# EAGLE design fen (EAGLE 8.3.2)
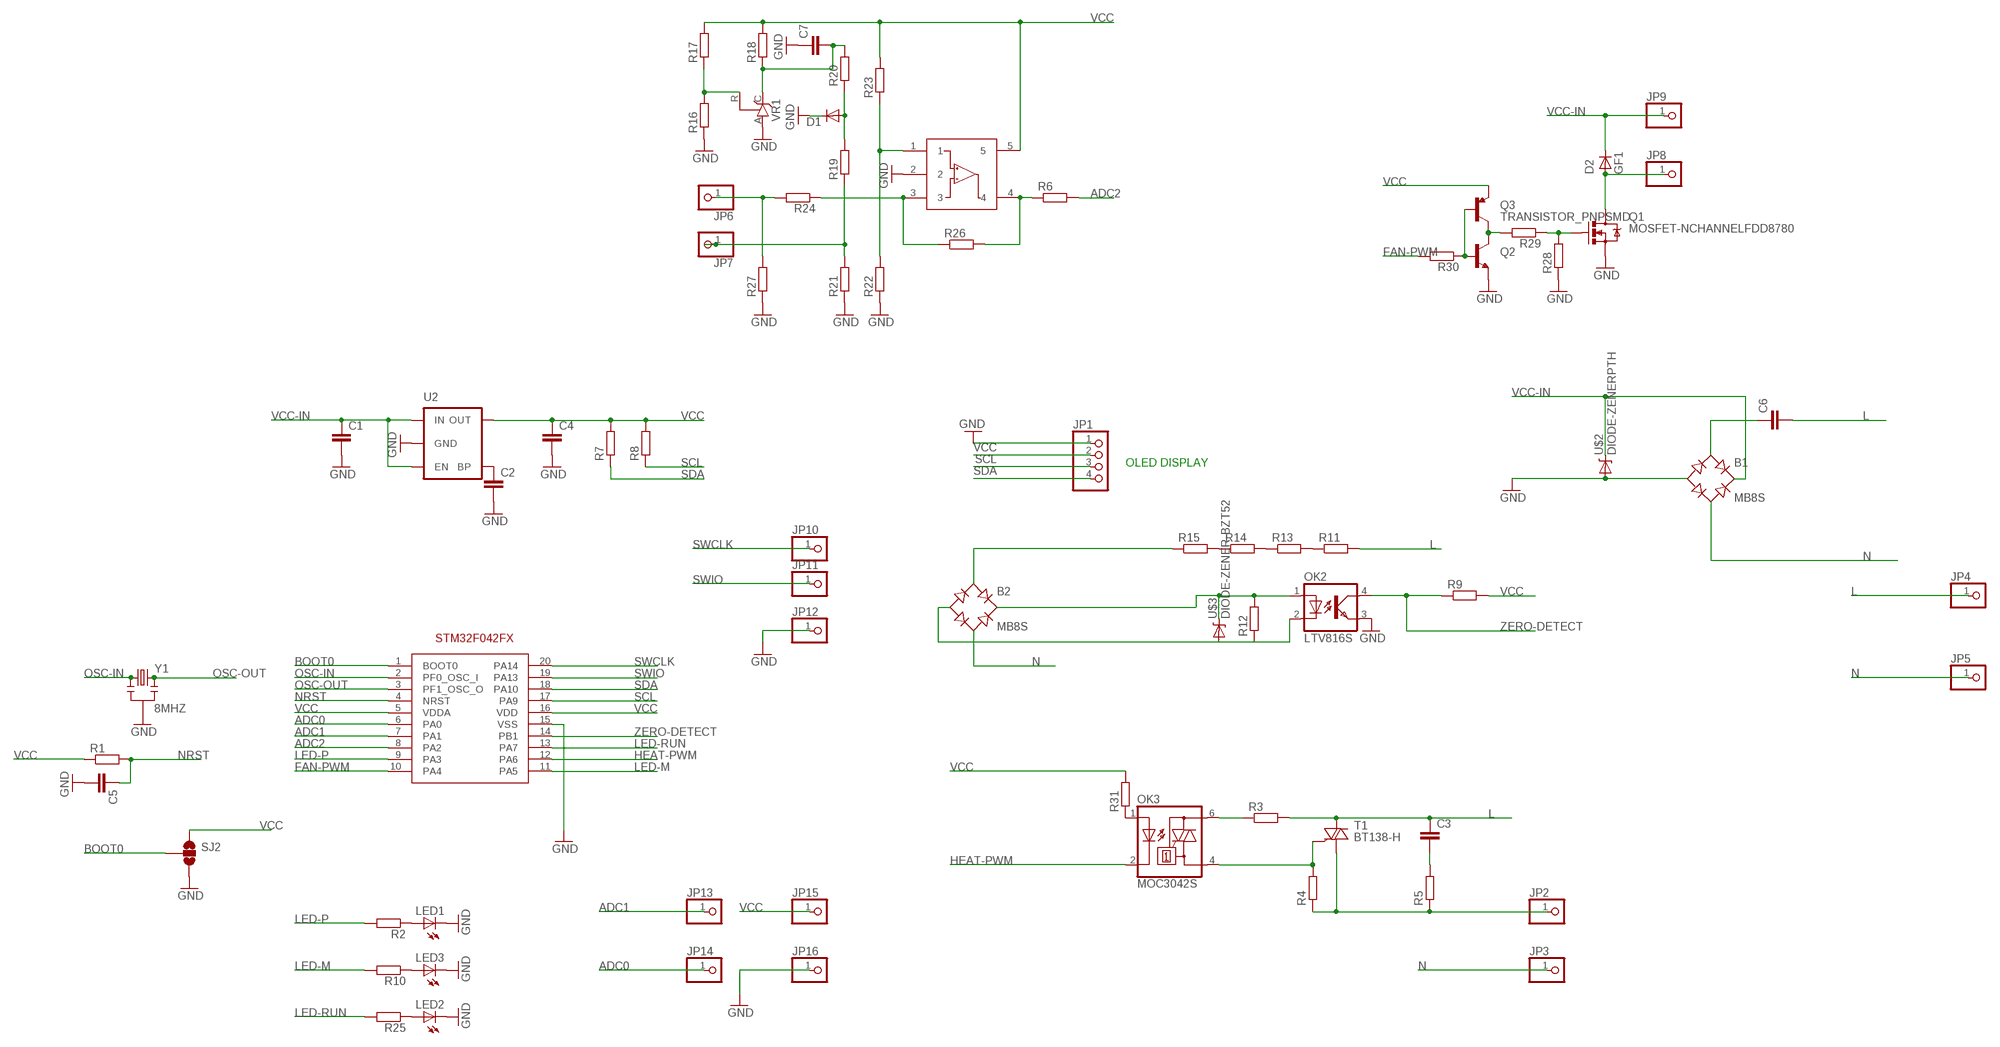
[diagram p0: schematic, sheet 1]

## Parts
B1  MB8S  [SOIC-4]
B2  MB8S  [SOIC-4]
C1  C-EUC0805  [C0805]
C2  C-EUC0603  [C0603]
C3  C-EUC1206  [C1206]
C4  C-EUC0805  [C0805]
C5  C-EUC0603  [C0603]
C6  C-EU150-072X183  [C150-072X183]
C7  C-EUC0805  [C0805]
D1  DIODE1N4148  [DIODE-1N4148]
D2  GF1  [SMA-DO214AC]
JP1  PINHD-1X4  [1X04]
JP2  PINHD-1X1  [1X01]
JP3  PINHD-1X1  [1X01]
JP4  PINHD-1X1  [1X01]
JP5  PINHD-1X1  [1X01]
JP6  PINHD-1X1  [1X01]
JP7  PINHD-1X1  [1X01]
JP8  PINHD-1X1  [1X01]
JP9  PINHD-1X1  [1X01]
JP10  PINHD-1X1  [1X01]
JP11  PINHD-1X1  [1X01]
JP12  PINHD-1X1  [1X01]
JP13  PINHD-1X1  [1X01]
JP14  PINHD-1X1  [1X01]
JP15  PINHD-1X1  [1X01]
JP16  PINHD-1X1  [1X01]
LED1  LED0603  [LED-0603]
LED2  LED0603  [LED-0603]
LED3  LED0603  [LED-0603]
OK2  LTV816S  [SMD4]
OK3  MOC3042S  [DIL6-SMD]
Q1  MOSFET-NCHANNELFDD8780  [DPAK]
Q2  TRANSISTOR_NPNSOT23  [SOT23]
Q3  TRANSISTOR_PNPSMD  [SOT23-3]
R1  R-EU_R0603  [R0603]
R2  R-EU_R0603  [R0603]
R3  R-EU_R1206  [R1206]
R4  R-EU_R1206  [R1206]
R5  R-EU_R1206  [R1206]
R6  R-EU_R0603  [R0603]
R7  R-EU_R0603  [R0603]
R8  R-EU_R0603  [R0603]
R9  R-EU_R0603  [R0603]
R10  R-EU_R0603  [R0603]
R11  R-EU_R1206  [R1206]
R12  R-EU_R0603  [R0603]
R13  R-EU_R1206  [R1206]
R14  R-EU_R1206  [R1206]
R15  R-EU_R1206  [R1206]
R16  R-EU_R0603  [R0603]
R17  R-EU_R0603  [R0603]
R18  R-EU_R0603  [R0603]
R19  R-EU_R0603  [R0603]
R20  R-EU_R0603  [R0603]
R21  R-EU_R0603  [R0603]
R22  R-EU_R0603  [R0603]
R23  R-EU_R0603  [R0603]
R24  R-EU_R0603  [R0603]
R25  R-EU_R0603  [R0603]
R26  R-EU_R0603  [R0603]
R27  R-EU_R0603  [R0603]
R28  R-EU_R0603  [R0603]
R29  R-EU_R0603  [R0603]
R30  R-EU_R0603  [R0603]
R31  R-EU_R0603  [R0603]
SJ2  SOLDERJUMPER_2WAYS  [SJ_3]
T1  BT138-H  [TO220BH]
U1  STM32F042FX  [TSSOP20]
U2  MIC52053.3V  [SOT23-5]
U$1  LMV321M5  [SOT23-5]
U$2  DIODE-ZENERPTH  [DIODE-ZENER]
U$3  DIODE-ZENER-BZT52  [SOD-323]
VR1  TL431CLP  [TO92-CLP]
Y1  8MHZ  RESONATOR8MHZ  [RESONATOR-SMD]

## Nets
ADC0: JP14.1 U1.6(PA0)
ADC1: JP13.1 U1.7(PA1)
ADC2: R6.2 U1.8(PA2)
BOOT0: SJ2.2 U1.1(BOOT0)
FAN-PWM: R30.2 U1.10(PA4)
GND: B1.- C1.2 C2.2 C4.2 C5.2 C7.1 D1.C JP1.1 JP12.1 JP16.1 LED1.C LED2.C LED3.C OK2.3(EMIT) Q1.3(S) Q2.2(E) R16.1 R21.1 R22.1 R27.1 R28.1 SJ2.3 U1.15(VSS) U2.2(GND) U$1.2 U$2.P$2(A) VR1.A Y1.2
HEAT-PWM: OK3.2(C) U1.12(PA6)
L: C3.1 C6.2 JP4.1 R3.2 R11.2 T1.T2(A2)
LED-M: R10.2 U1.11(PA5)
LED-P: R2.2 U1.9(PA3)
LED-RUN: R25.2 U1.13(PA7)
N: B1.~2(AC2) B2.~2(AC2) JP3.1 JP5.1
N$1: LED2.A R25.1
N$2: OK3.4(A1) R4.2 T1.G
N$3: OK3.6(A2) R3.1
N$4: C3.2 R5.2
N$5: JP2.1 R4.1 R5.1 T1.T1(A1)
N$6: R6.1 R26.2 U$1.4
N$7: C2.1 U2.4(BP)
N$8: B2.- OK2.2(C) R12.1 U$3.2(A)
N$10: B1.~1(AC1) C6.1
N$11: R11.1 R13.2
N$12: R14.1 R15.2
N$13: R13.1 R14.2
N$14: OK3.1(A) R31.1
N$15: B2.+ OK2.1(A) R12.2 U$3.1(C)
N$16: R16.2 R17.1 VR1.R
N$17: D2.A JP8.1 Q1.4(D)
N$18: C7.2 R18.1 R20.2 VR1.C
N$19: R22.2 R23.1 U$1.1
N$20: R24.1 R26.1 U$1.3
N$21: JP6.1 R24.2 R27.2
N$22: JP7.1 R19.1 R21.2
N$23: D1.A R19.2 R20.1
N$24: Q1.1(G) R28.2 R29.1
N$25: Q2.3(C) Q3.3(C) R29.2
N$26: Q2.1(B) Q3.1(B) R30.1
N$27: B2.~1(AC1) R15.1
N$28: LED3.A R10.1
N$29: LED1.A R2.1
NRST: C5.1 R1.2 U1.4(NRST)
OSC-IN: U1.2(PF0_OSC_I) Y1.1
OSC-OUT: U1.3(PF1_OSC_O) Y1.3
SCL: JP1.3 R8.1 U1.17(PA9)
SDA: JP1.4 R7.1 U1.18(PA10)
SWCLK: JP10.1 U1.20(PA14)
SWIO: JP11.1 U1.19(PA13)
VCC: C4.1 JP1.2 JP15.1 Q3.2(E) R1.1 R7.2 R8.2 R9.2 R17.2 R18.2 R23.2 R31.2 SJ2.1 U1.5(VDDA) U1.16(VDD) U2.5(OUT) U$1.5
VCC-IN: B1.+ C1.1 D2.K(C) JP9.1 U2.1(IN) U2.3(EN) U$2.P$1(C)
ZERO-DETECT: OK2.4(COL) R9.1 U1.14(PB1)

## Notes on the sheet
- OLED DISPLAY

## Library data of the parts
B1 B2 = rectifier:MB*S: Bridge Rectifier Source: http://www.fairchildsemi.com/ds/MB/MB6S.pdf
C1-C7 = rcl:C-EU: CAPACITOR, European symbol
D1 = SparkFun-DiscreteSemi:DIODE: Diode These are standard reverse protection diodes and small signal diodes. SMA package can handle up to about 1A. SOD-323 can handle about 200mA. What the SOD-323 package when ordering, there are some mfgs out there that are 5-pin packages.
D2 = diode:GF1: DIODE
JP1 = pinhead:PINHD-1X4: PIN HEADER
JP2-JP16 = pinhead:PINHD-1X1: PIN HEADER
LED1-LED3 = SparkFun-LED:LED: LEDs Standard schematic elements and footprints for 5mm, 3mm, 1206, and 0603 sized LEDs. 5mm - Spark Fun Electronics SKU : COM-00529 (and others)
OK2 = optocoupler:LTV816: OPTO COUPLER Source: LITEON, LTV816.pdf; OC_FARNELL: unknown; OC_NEWARK: unknown
OK3 = optocoupler:MOC30*: 6-Pin DIP Zero-Cross Optoisolators Triac Driver Output (250/400 Volt Peak) Source: Data sheet <http://www.fairchildsemi.com/ds/MO/MOC3031M.pdf> The old path of data sheet not more available 2013-05-06.; MF: FAIRCHILD SEMICONDUCTOR; MPN: MOC3042SM; OC_FARNELL: unknown; OC_NEWARK: 34C1339
Q1 = SparkFun-DiscreteSemi:MOSFET-NCHANNEL: Common NMOSFET Parts MFG P/N Store ID Prod ID FDD8780 TRANS-09984 SI7820DN TRANS-11055 FDS6630A IC-08089 2N7002PW TRANS-11151 FQP30N06L COM-10213 TRANS-10060 BSS123LT1G TRANS-08345 BSS138 TRANS-00830 BS170 2N7000; PROD_ID: TRANS-09984
Q2 = SparkFun-DiscreteSemi:TRANSISTOR_NPN: Generic NPN BJT. MMBT2222 is the common NPN we use. Double check against datasheet- not all devices are the same!
Q3 = SparkFun-DiscreteSemi:TRANSISTOR_PNP: Generic PNP BJT. Double check pinouts against datasheets- not all devices are the same!
R1-R31 = rcl:R-EU_: RESISTOR, European symbol
SJ2 = SparkFun-Passives:SOLDERJUMPER_2WAY: Solder Jumper 2 way solder jumper
T1 = triac:BT138: TRIAC Source: http://www.semiconductors.philips.com BT138_SERIES_2.pdf
U1 = STM32F042Fx:STM32F042FX: STM32F042Fx microcontroller
U2 = SparkFun-PowerIC:MIC5205: MIC5205 150mA vreg 3.3V - VREG-00822 5V - VREG-00823; PROD_ID: VREG-00822
U$1 = SparkFun-AnalogIC:LMV321M5
U$2 U$3 = SparkFun-DiscreteSemi:DIODE-ZENER: Zener Diode Production Part - 8199 3.4V Zener Voltage
VR1 = v-reg:TL431CLP: VOLTAGE REGULATOR
Y1 = SparkFun-FreqCtrl:RESONATOR: Resonator Small SMD resonator. Used, eg, on the Arduino Pro/ Pro Mini boards. 8MHz- XTAL-08895 16MHz- XTAL-08900; PROD_ID: XTAL-08895

## Board
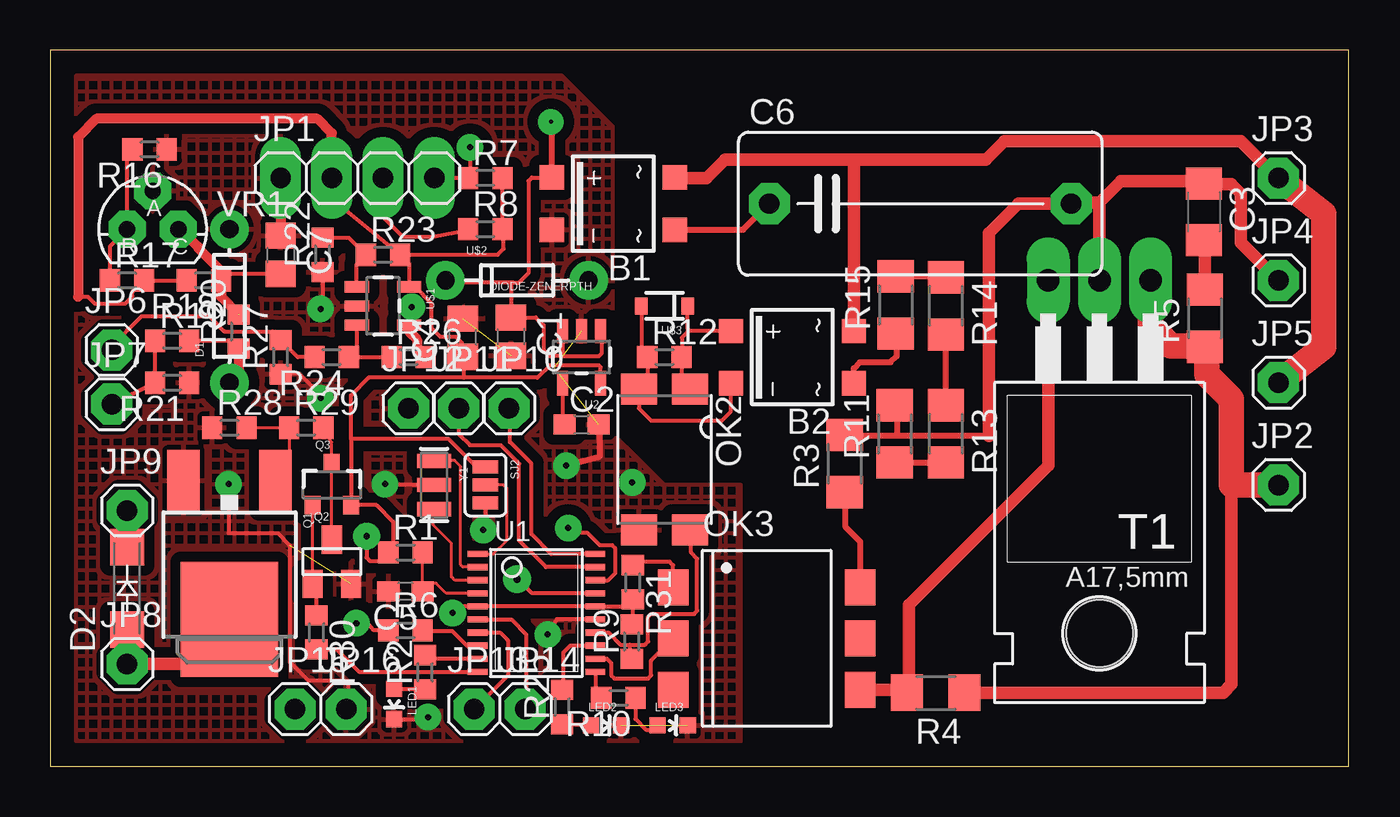
[diagram p1: board, top side]
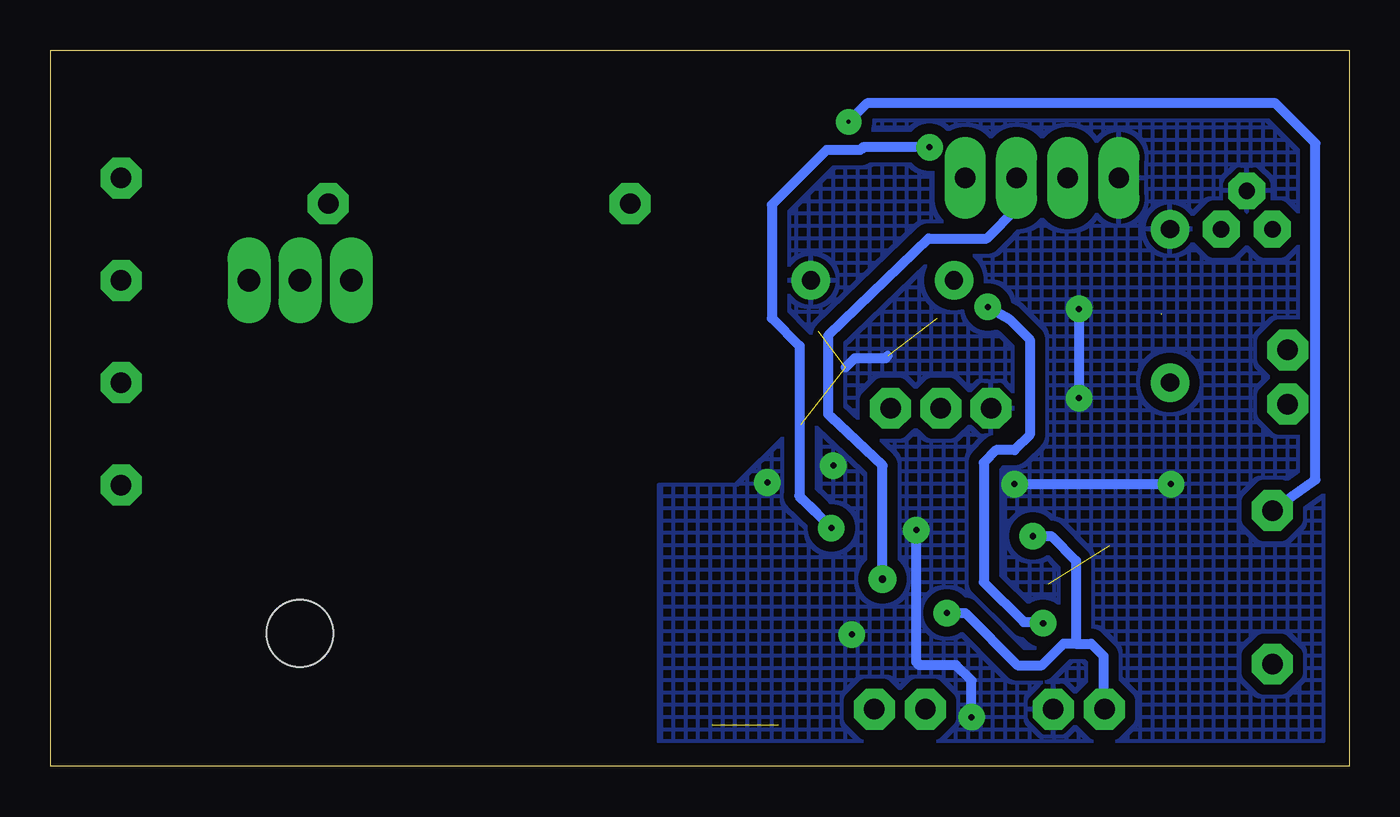
[diagram p2: board, bottom side, seen from below]

Size 64.44 x 35.55 mm. Coordinates in mm from the lower left corner, seen from the top.
Outline: 0,0 64.44,0 64.44,35.55 0,35.55 0,0
Copper layers (1*16): Top 0.035mm / dielectric 1.5mm / Bottom 0.035mm
Design rules "default *": minimum track width 20mil, minimum drill 24mil, track to track 20mil, track to pad 20mil, pad to pad 20mil, via to via 20mil, smd to smd 8mil, copper to edge 40mil, drill to drill 20mil, minimum pad ring 20mil, minimum via ring 20mil, stop-mask expansion 4mil, vias tented up to drill 0mil, thermal gap 10mil

### Footprints (pad centres in the part's own frame; a part is rotated, then mirrored left to right if it is on the bottom)
SOIC-4 = smd 1.2 x 1.2: + 1.3,3.05; - -1.3,3.05; ~1 -1.3,-3.05; ~2 1.3,-3.05
C0805 = smd 1.3 x 1.5: 1 -0.95,0; 2 0.95,0
C0603 = smd 1.1 x 1: 1 -0.85,0; 2 0.85,0
C1206 = smd 1.6 x 1.8: 1 -1.4,0; 2 1.4,0
C150-072X183 = drill 1.016 octagon: 1 -7.493,0; 2 7.493,0
DIODE-1N4148 = drill 0.9 pad 1.88: A -3.81,0; C 3.81,0
SMA-DO214AC = smd 1.8 x 1.7: A -2.05,0; K 2.05,0
1X04 = drill 1.016 long: 1 -3.81,0; 2 -1.27,0; 3 1.27,0; 4 3.81,0
1X01 = drill 1.016 octagon: 1 0,0
LED-0603 = smd 0.8 x 0.8: A 0,-0.75; C 0,0.75
SMD4 = smd 1.78 x 1.55: 1 -1.27,-3.5; 2 1.27,-3.5; 3 1.27,3.5; 4 -1.27,3.5
DIL6-SMD = smd 1.78 x 1.52: 1 -2.54,-4.645; 2 0,-4.645; 3 2.54,-4.645; 4 2.54,4.645; 5 0,4.645; 6 -2.54,4.645
DPAK = smd 1.6 x 3: 1 -2.28,-5.31; 3 2.28,-5.31 | smd 4.826 x 5.715: 4 0,1.588
SOT23 = smd 1 x 1.4: 1 -0.95,-1.1; 2 0.95,-1.1; 3 0,1.1
SOT23-3 = smd 0.8 x 0.9: 1 -0.95,-1; 2 0.95,-1; 3 0,1.1
R0603 = smd 1 x 1.1: 1 -0.85,0; 2 0.85,0
R1206 = smd 1.6 x 1.803: 1 -1.422,0; 2 1.422,0
SJ_3 = smd 0.635 x 1.27: 1 -0.889,0; 2 0,0; 3 0.889,0
TO220BH = drill 1.118 long: G 2.54,-6.35; T1 -2.54,-6.35; T2 0,-6.35 | hole 3.302: 0,11.176
TSSOP20 = smd 0.305 x 0.991: 1 -2.925,-2.918; 2 -2.275,-2.918; 3 -1.625,-2.918; 4 -0.975,-2.918; 5 -0.325,-2.918; 6 0.325,-2.918; 7 0.975,-2.918; 8 1.625,-2.918; 9 2.275,-2.918; 10 2.925,-2.918; 11 2.925,2.918; 12 2.275,2.918; 13 1.625,2.918; 14 0.975,2.918; 15 0.325,2.918; 16 -0.325,2.918; 17 -0.975,2.918; 18 -1.625,2.918; 19 -2.275,2.918; 20 -2.925,2.918
SOT23-5 = smd 0.55 x 1.2: 1 -0.95,-1.3; 2 0,-1.3; 3 0.95,-1.3; 4 0.95,1.3; 5 -0.95,1.3
DIODE-ZENER = drill 0.9: P$1 -3.556,0; P$2 3.556,0
SOD-323 = smd 0.63 x 0.83: 1 -1.15,0; 2 1.15,0
TO92-CLP = drill 0.813 octagon: A 0,1.905; C 1.27,0; R -1.27,0
RESONATOR-SMD = smd 0.7 x 1.7: 1 -1.2,0; 2 0,0; 3 1.2,0

### Placement (x,y rotation side)
B1  27.94,27.94 90 top
B2  36.83,20.32 90 top
C1  22.86,21.34 270 top
C2  26.37,16.97 0 top
C3  57.25,27.53 270 top
C4  20.47,21.29 90 top
C5  17.63,8.69 180 top
C6  43.18,27.94 0 top
C7  11.43,25.4 270 top
D1  8.89,22.86 90 top
D2  3.81,8.84 90 top
JP1  15.24,29.21 0 top
JP2  60.96,13.97 0 top
JP3  60.96,29.21 0 top
JP4  60.96,24.13 0 top
JP5  60.96,19.05 0 top
JP6  3.05,20.68 0 top
JP7  3.05,17.98 0 top
JP8  3.81,5.08 0 top
JP9  3.81,12.7 0 top
JP10  22.76,17.78 0 top
JP11  20.27,17.78 0 top
JP12  17.78,17.78 0 top
JP13  21.03,2.84 0 top
JP14  23.57,2.84 0 top
JP15  12.14,2.84 0 top
JP16  14.68,2.84 0 top
LED1  17.07,3.1 180 top
LED2  27.58,2.03 270 top
LED3  30.89,2.03 270 top
OK2  30.48,15.24 180 top
OK3  35.56,6.35 270 top
Q1  8.89,8.89 180 top
Q2  13.97,10.16 0 top
Q3  13.97,13.97 0 top
R1  17.63,10.62 0 top
R2  18.59,4.67 90 top
R3  39.42,15.04 90 top
R4  43.94,3.66 180 top
R5  57.3,22.25 90 top
R6  17.63,6.76 0 top
R7  21.59,29.21 0 top
R8  21.59,26.67 0 top
R9  28.85,6.2 90 top
R10  28.19,3.4 180 top
R11  41.91,16.51 90 top
R12  30.48,20.32 0 top
R13  44.45,16.51 270 top
R14  44.45,22.86 270 top
R15  41.96,22.91 90 top
R16  4.93,30.63 180 top
R17  3.81,24.13 0 top
R18  7.62,24.13 180 top
R19  6.05,21.13 0 top
R20  9.35,21.59 90 top
R21  6.05,19.05 180 top
R22  13.51,25.4 90 top
R23  16.51,25.4 0 top
R24  13.97,20.32 180 top
R25  25.4,2.95 90 top
R26  17.78,20.32 0 top
R27  11.43,20.32 90 top
R28  8.89,16.81 0 top
R29  12.7,16.81 0 top
R30  13.21,6.65 270 top
R31  28.91,9.14 270 top
SJ2  21.59,13.97 270 top
T1  52.07,17.78 180 top
U1  24.13,7.62 270 top
U2  26.37,20.32 180 top
U$1  16.51,22.86 270 top
U$2  23.16,24.13 0 top
U$3  30.48,22.86 180 top
VR1  5.08,26.67 0 top
Y1  19.05,13.97 270 top

### Tracks (layer width: path | path; a pad name or v marks a point on that pad's centre or on a via)
ADC0
  Top 0.203: U1.6 22.88,7.29 23.62,6.55 23.62,2.9 JP14.1
ADC1
  Top 0.203: U1.7 22.31,6.64 22.71,6.25 22.71,4.52 JP13.1
ADC2
  Top 0.203: U1.8 20.68,6 19.96,6.71 18.53,6.71 R6.2
BOOT0
  Top 0.152: U1.1 21.98,10.54 22.66,11.23 22.66,13.82 22.5,13.97 SJ2.2
FAN-PWM
  Top 0.203: U1.10 15.32,4.7 14.21,5.8 R30.2
GND  (via drill 0.3, 0.3 pad 0.9, 0.3 pad 1.27)  (6 unrouted)
  Top 0.203: U1.15 25.17,7.29 25.15,7.32 v24.69,6.55 | SJ2.3 21.59,11.84 v21.49,11.73 | v18.75,2.44 18.44,2.44 18.29,2.29 18.23,2.35 LED1.C | Y1.2 16.66,13.97 v16.61,14.02 | v8.84,14.02 8.84,11.58 11.28,11.58 11.89,10.97 11.89,5.18 12.8,4.27 14.63,4.27 14.78,4.12 14.78,2.95 JP16.1 | R22.1 13.51,22.81 v13.41,22.71 | v13.41,18.29 13.41,18.44 12.34,19.51 11.47,19.51 R27.1
  Top 0.305: v25.6,14.94 27.28,15.39 27.28,16.9 C2.2
  Top 0.508: JP1.1 C7.1
  Bottom 0.508: v21.49,11.73 21.49,5.18 21.34,5.03 19.51,5.03 18.75,4.27 v18.75,2.44 | v16.61,14.02 v8.84,14.02 | v13.41,22.71 v13.41,18.29 | 24.99,19.81 24.54,20.27 23.01,20.27 22.9,20.39
  other vias: 28.88,14.1
  pour Top (isolate 0.254, hatched): 1.27,1.27 34.29,1.27 34.29,13.97 30.48,13.97 26.67,17.78 26.67,20.32 27.94,21.59 27.94,31.75 25.4,34.29 1.27,34.29
  pour Bottom (hatched): 1.27,34.29 25.4,34.29 29.21,30.48 29.21,22.86 27.94,21.59 27.94,16.51 30.48,13.97 34.29,13.97 34.29,1.27 1.27,1.27
HEAT-PWM
  Top 0.203: U1.12 27.62,5.34 27.84,5.13 27.84,4.52 27.99,4.37 29.67,4.37 29.82,4.52 29.82,5.25 OK3.2
L
  Top 0.305: R11.2 42.01,17.83 42.01,16.41 | 46.58,16.41 42.01,16.41 | R3.2 39.47,16.41 42.01,16.41
  Top 0.61: 46.58,16.41 46.58,26.47 48.06,27.94 C6.2 50.72,27.99 52.07,27.99 | T1.T2 52.07,27.99 | JP4.1 59.08,26.01 59.08,28.45 58.62,28.91 57.28,28.91 C3.1 57.13,29.06 53.14,29.06 52.07,27.99
LED-M
  Top 0.203: U1.11 27.05,3.55 R10.2
LED-P
  Top 0.203: U1.9 18.77,5.34 R2.2
LED-RUN
  Top 0.203: U1.13 25.81,6 25.45,5.64 25.45,3.85 R25.2
N
  Top 0.305: B2.~2
  Top 0.61: JP3.1 60.91,29.21 59.08,31.04 47.35,31.04 46.43,30.12 40.03,30.12 | 40.03,30.12 33.48,30.12 32.56,29.21 31.02,29.21 B1.~2 | B2.~2 39.88,29.97 40.03,30.12
  Top 1.27: JP5.1 63.2,20.83 63.2,27.43 JP3.1
N$1
  Top 0.203: R25.1 26.62,2.1 LED2.A
N$2
  Top 0.61: T1.G 49.53,14.94 42.62,8.03 42.62,3.76 R4.2 42.37,3.81 OK3.4
N$3
  Top 0.305: 40.15,8.94 OK3.6 40.2,11.15 39.47,11.89 39.47,13.56 R3.1
N$4
  Top 0.61: R5.2 57.3,26.08 C3.2
N$5
  Top 0.61: R4.1 58.22,3.66 58.62,4.06 58.62,13.97 | R5.1 57.4,20.73
  Top 1.27: 57.4,20.73 57.4,19.46 58.62,18.24 58.62,13.97 JP2.1 | 57.25,20.88 R5.1 57.25,20.88 | T1.T1 54.61,21.89 55.63,20.88 57.25,20.88
N$6  (via drill 0.3 pad 0.9, 0.3 pad 1.27)
  Top 0.203: R6.1 16.05,6.76 15.7,7.16 v15.19,7.11
  Top 0.508: v17.93,22.81 17.93,22.03 U$1.4 17.81,21.57 18.19,21.19 18.19,20.76 R26.2
  Bottom 0.508: v15.19,7.11 15.24,7.16 16.15,7.16 18.14,9.14 18.14,15.09 17.53,15.7 16.61,15.7 15.85,16.46 15.85,21.18 16.87,22.2 v17.93,22.81
N$7
  Top 0.203: U2.4 25.41,17.07 C2.1
N$8
  Top 0.203: U$3.2 29.33,20.62 R12.1 29.63,19.16 OK2.2 29.21,17.78 29.82,17.17 33.33,17.17 33.78,17.63 B2.-
N$10
  Top 0.305: B1.~1 34.39,26.64 C6.1
N$11
  Top 0.305: R11.1 R13.2
N$12
  Top 0.305: R15.2 44.4,24.33 R14.1
N$13
  Top 0.305: R13.1 R14.2
N$14
  Top 0.203: OK3.1 30.91,9.98 30.73,10.16 29.07,10.16 R31.1
N$15
  Top 0.203: 31.63,21.74 U$3.1 | 31.63,21.74 31.63,21.57 31.34,21.29 31.34,20.33 R12.2 31.33,19.16 OK2.1 | B2.+ 31.75,21.62 31.63,21.74
N$16
  Top 0.203: R16.2 3.81,30.06 VR1.R 2.96,25.82 R17.1
N$17
  Top 0.305: JP8.1 D2.A
  Top 0.61: JP8.1 6.67,5.08 Q1.4
N$18  (1 unrouted)
  Top 0.203: C7.2 8.79,24.45 8.71,24.36 R18.1
  Top 0.508: VR1.C 6.46,26.67 7.34,25.78 7.34,25.73 8.71,24.36 | R18.1 8.47,23.32 9.33,22.45
N$19
  Top 0.203: U$1.1 15.21,24.95 R23.1 14.81,26.25 R22.2
N$20
  Top 0.203: R26.1 R24.1 15.21,20.71 U$1.3
N$21
  Top 0.203: JP6.1 3.81,21.64 4.52,22.35 7.87,22.35 8.64,21.59 11.01,21.59 R27.2 12.28,20.32 R24.2
N$22
  Top 0.203: JP7.1 R21.2 R19.1
N$23
  Top 0.203: R19.2 8.95,21.13 R20.1 8.89,20.28
  Top 0.508: R20.1 9.35,19.51 D1.A
N$24
  Top 0.152: R28.2 R29.1 11.85,14.88 Q1.1
N$25
  Top 0.152: Q2.3 Q3.3 13.97,16.09 R29.2
N$26
  Top 0.152: Q2.1 Q3.1
  Top 0.203: R30.1 13.21,8.87 Q2.1
N$27
  Top 0.305: B2.~1 39.88,19.76 40.18,20.07 41.71,20.07 42.01,20.37 42.01,21.44 R15.1
N$28
  Top 0.203: R10.1 29.04,2.35 29.57,1.83 30.24,1.83 LED3.A
N$29
  Top 0.203: R2.1 17.09,3.82 LED1.A
NRST
  Top 0.152: 18.48,9.09 R1.2 | 18.48,9.09 C5.1 | U1.4 19.65,8.6 19.15,9.09 18.48,9.09
OSC-IN
  Top 0.152: U1.2 20.48,9.89 20.37,10.01 20.37,14.88 20.07,15.19 19.07,15.19 Y1.1
OSC-OUT
  Top 0.152: U1.3 20.07,9.24 19.91,9.4 19.91,11.07 19,11.99 19,12.72 Y1.3
SCL  (via drill 0.35)
  Top 0.203: JP1.3 16.51,27.28 17.48,26.31 19,26.31 20.69,26.62 R8.1 | U1.17 23.92,8.6 23.57,8.94
  Top 0.206: 23.57,8.94 23.52,8.94 v23.16,9.3
  Bottom 0.203: 16.46,29.16 JP1.3 | 25.86,17.48 25.76,17.37
  Bottom 0.508: v23.16,9.3 23.16,14.94 25.76,17.37 | 16.46,29.16 16.46,27.74 17.98,26.21 20.88,26.21 25.86,21.39 25.86,17.48
SDA  (via drill 0.3 pad 0.9, 0.3 pad 1.27)
  Top 0.203: JP1.4 R7.1 20.83,29.3 v20.83,30.73 | U1.18 27.68,9.24 28.04,9.6 28.04,10.82 27.89,10.97 27.28,10.97 26.67,11.58 25.96,11.58 v25.7,11.84
  Bottom 0.508: v20.83,30.73 24.14,30.73 24.26,30.61 25.93,30.61 28.65,27.89 28.65,22.25 27.28,20.88 27.28,13.44 26.39,12.55 27.31,13.44 v25.7,11.84
SWCLK
  Top 0.203: U1.20 24.86,10.54 23.88,11.53 23.88,15.04 22.81,16.1 22.81,17.73 JP10.1
SWIO
  Top 0.203: JP11.1 20.27,16.51 20.83,15.95 22.35,15.95 23.27,15.04 23.27,11.23 24.6,9.89 U1.19
VCC  (via drill 0.3 pad 0.9)
  Top 0.203: R9.2 28.91,7.1 R31.2 28.56,7.95 U1.16 U1.5 20.29,7.95 v19.96,7.62 | SJ2.1 21.16,14.86 19.76,16.26 14.92,16.26 | U2.5 27.32,19.83 27.23,19.91 24.79,19.91 24.18,19.3 20.52,19.3 | 20.52,19.3 20.52,20.28 C4.1 20.42,20.39 20.42,21.03 20.12,21.34 19.36,21.34 18.9,21.79 18.9,23.01 18.1,23.81 U$1.5 17.81,24.95 R23.2 | R23.2 22.2,25.4 22.5,25.7 22.5,26.61 R8.2 R7.2 | R23.2 13.97,28.18 JP1.2 14.02,29.26 | R18.2 R17.2 4.07,23.54 4.07,23.33 3.71,22.97 2.21,22.97 1.86,23.32 1.37,23.32 | 14.92,16.26 14.92,18.43 15.8,19.3 20.52,19.3 | 14.92,16.26 Q3.2 16.19,12.97 17.02,12.14 17.02,10.25 R1.1 16.88,10.21 15.85,10.21 15.7,10.36 v15.7,11.43
  Top 0.508: JP1.2 13.97,31.45 13.26,32.16 2.29,32.16 1.37,31.24 1.37,23.32
  Bottom 0.203: 12.19,2.9 JP15.1
  Bottom 0.508: v19.96,7.62 19.05,7.62 16.46,5.03 15.24,5.03 14.17,6.1 13.56,6.1 | 13.56,6.1 12.8,6.1 12.19,5.49 12.19,2.9 | v15.7,11.43 14.78,11.43 13.56,10.21 13.56,6.1
VCC-IN  (via drill 0.2 pad 1.27)
  Top 0.203: B1.+ 23.91,29.24 23.72,29.06 23.72,24.49 23.27,24.03 22.96,24.03 | 22.96,24.03 19.56,24.03 U$2.P$1 | 22.96,24.03 22.86,23.98 C1.1 24.09,22.29 24.49,21.89 24.49,20.68 24.79,20.37 25.4,20.37 | 25.4,20.37 27.23,20.37 27.38,20.52 27.38,21.55 U2.1 | U2.3 25.41,20.39 25.4,20.37
  Top 0.305: B1.+ 24.89,31.95 v24.84,32 | D2.K JP9.1
  Bottom 0.508: JP9.1 1.68,14.22 1.68,30.94 3.66,32.92 23.93,32.92 v24.84,32
ZERO-DETECT
  Top 0.203: U1.14 27.7,6.64 28.3,6.04 28.75,6.04 | 28.75,6.04 28.75,5.45 R9.1 | 28.75,6.04 29.52,6.04 29.67,6.2 29.67,7.42 29.82,7.57 31.95,7.57 32.11,7.72 32.11,10.31 31.8,10.62 31.8,11.69 OK2.4